# EAGLE design ZPlusSunSensorBoard (EAGLE 9.6.2)
DESIGNER: T. Christison
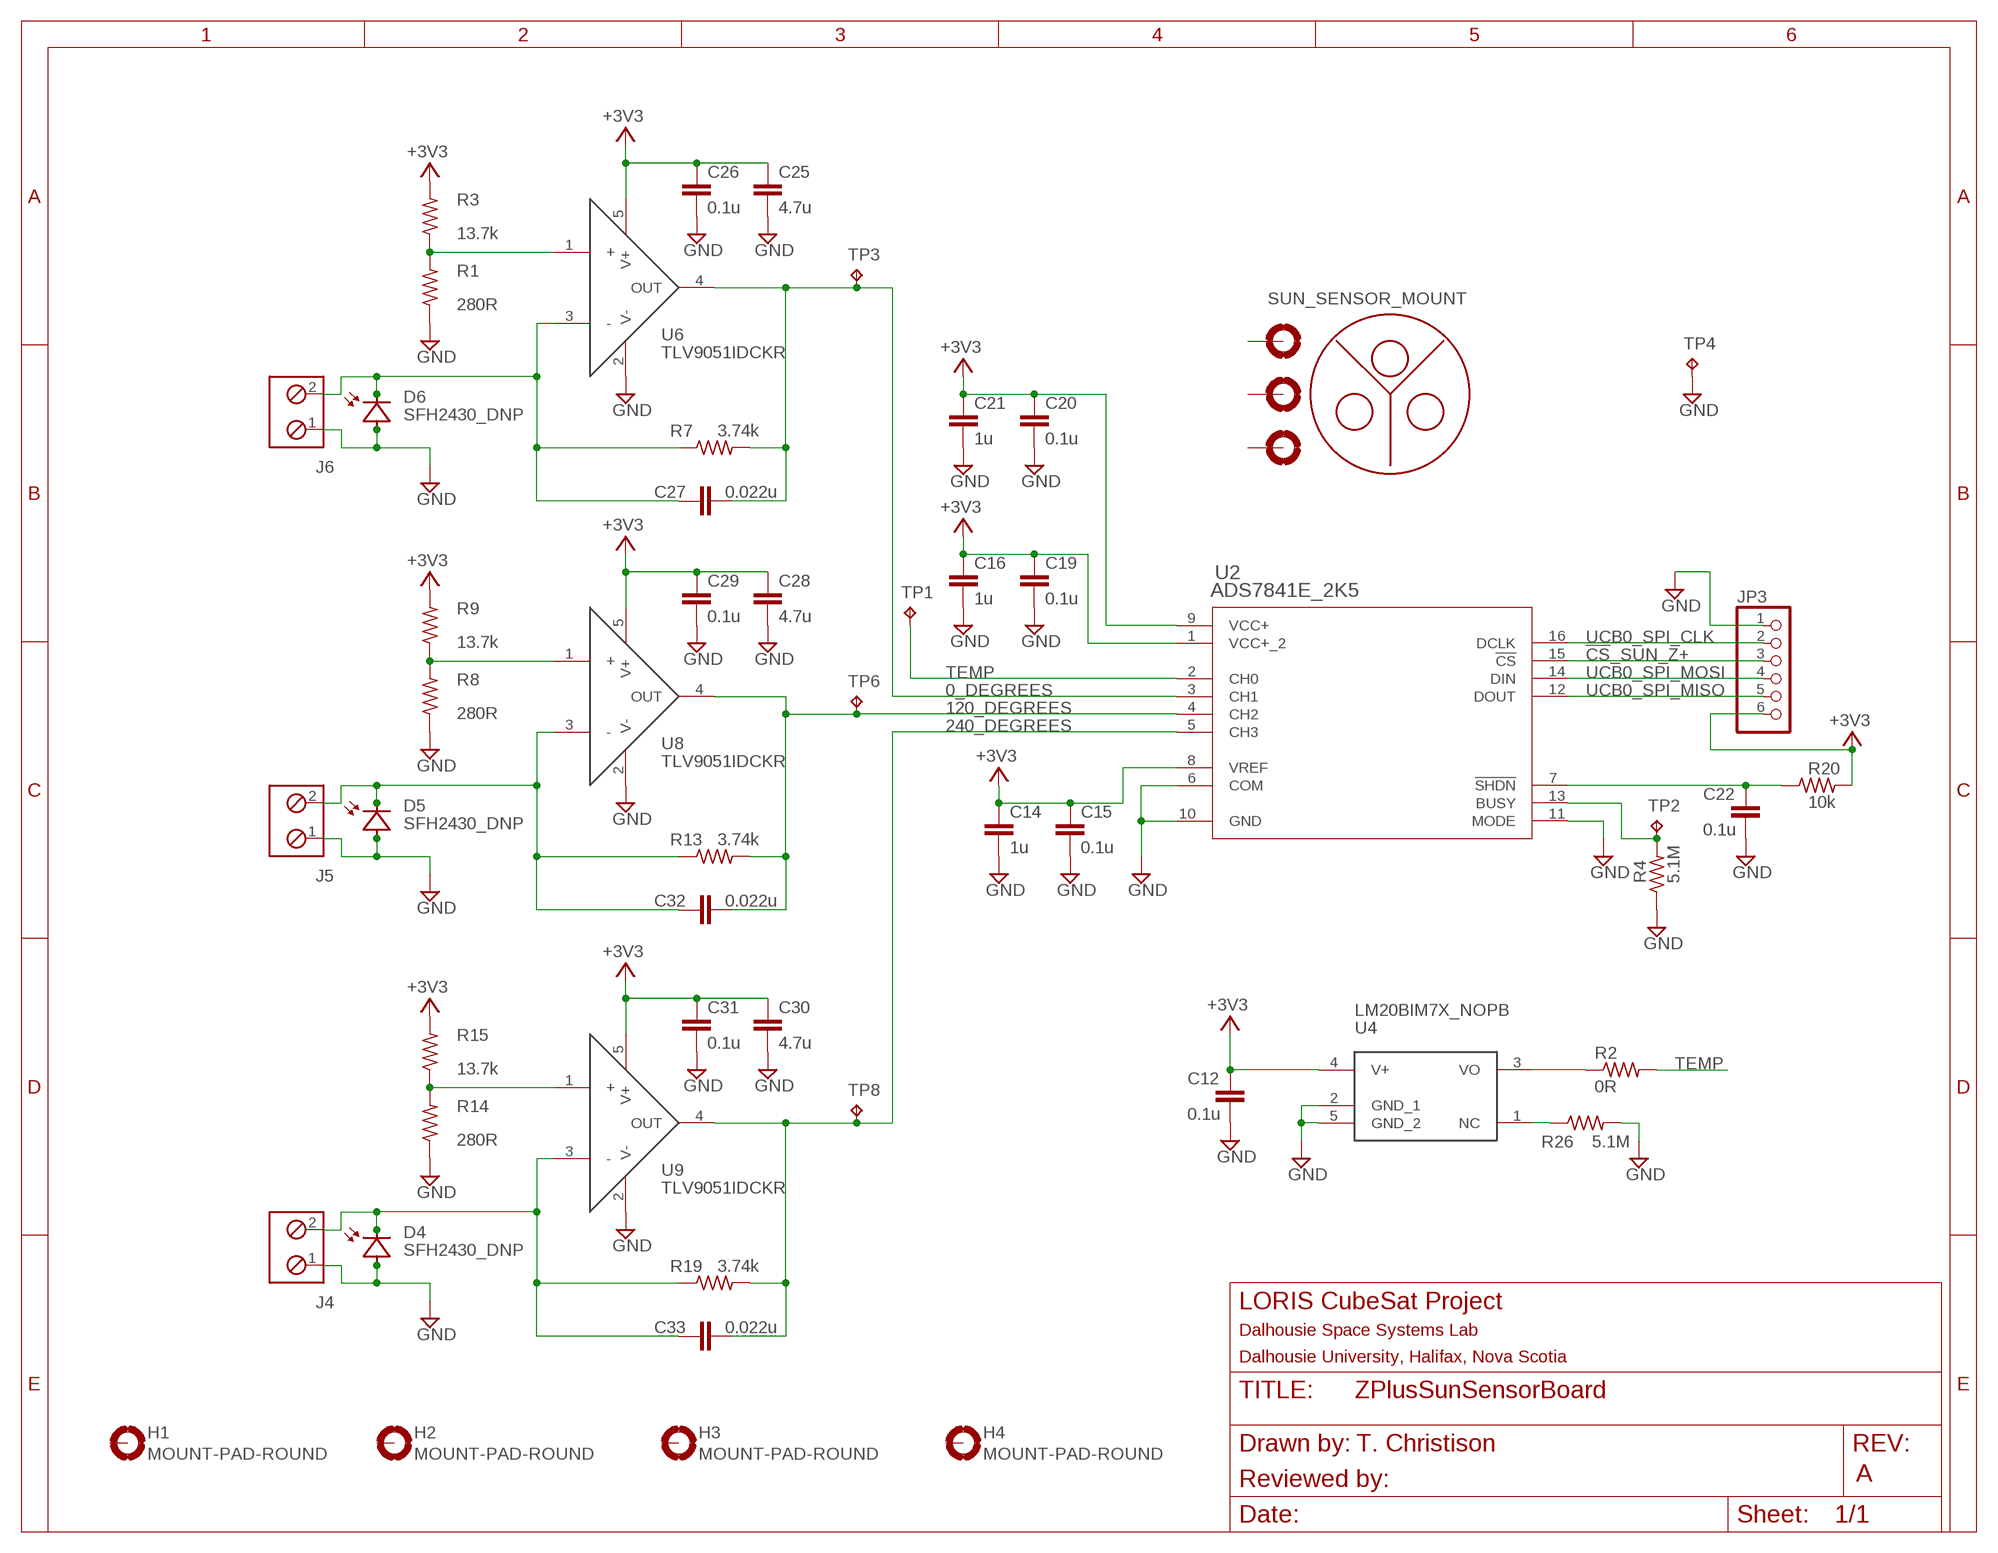
[diagram p0: schematic, sheet 1]

## Parts
A1  SUN_SENSOR_MOUNT  [SUN_SENOR_MASK]
C12  0.1u  C-EUC0402  [C0402]
C14  1u  C-EUC0402  [C0402]
C15  0.1u  C-EUC0402  [C0402]
C16  1u  C-EUC0402  [C0402]
C19  0.1u  C-EUC0402  [C0402]
C20  0.1u  C-EUC0402  [C0402]
C21  1u  C-EUC0402  [C0402]
C22  0.1u  C-EUC0402  [C0402]
C25  4.7u  C-EUC0805  [C0805]
C26  0.1u  C-EUC0402  [C0402]
C27  0.022u  C-EUC0402  [C0402]
C28  4.7u  C-EUC0805  [C0805]
C29  0.1u  C-EUC0402  [C0402]
C30  4.7u  C-EUC0805  [C0805]
C31  0.1u  C-EUC0402  [C0402]
C32  0.022u  C-EUC0402  [C0402]
C33  0.022u  C-EUC0402  [C0402]
H1  MOUNT-PAD-ROUND  [PC104]
H2  MOUNT-PAD-ROUND  [PC104]
H3  MOUNT-PAD-ROUND  [PC104]
H4  MOUNT-PAD-ROUND  [PC104]
J4  TRM_BLK_1X2  [2POL254]
J5  TRM_BLK_1X2  [2POL254]
J6  TRM_BLK_1X2  [2POL254]
JP3  PINHD-1X6  [1X06]
R1  280R  R-US_R0402  [R0402]
R2  0R  R-US_R0805  [R0805]
R3  13.7k  R-US_R0402  [R0402]
R4  5.1M  R-US_R0402  [R0402]
R7  3.74k  R-US_R0402  [R0402]
R8  280R  R-US_R0402  [R0402]
R9  13.7k  R-US_R0402  [R0402]
R13  3.74k  R-US_R0402  [R0402]
R14  280R  R-US_R0402  [R0402]
R15  13.7k  R-US_R0402  [R0402]
R19  3.74k  R-US_R0402  [R0402]
R20  10k  R-US_R0402  [R0402]
R26  5.1M  R-US_R0402  [R0402]
TP1  TESTPOINT  [TP_P76H50]
TP2  TESTPOINT  [TP_P76H50]
TP3  TESTPOINT  [TP_P76H50]
TP4  TESTPOINT  [TP_P76H50]
TP6  TESTPOINT  [TP_P76H50]
TP8  TESTPOINT  [TP_P76H50]
U2  ADS7841E_2K5  [DBQ16]
U4  LM20BIM7X_NOPB  [SOT23-5P65_210X110L40X22N_LM20]
U6  TLV9051IDCKR  [SC70-5P65_210X110L36X22N_TLV9051]
U8  TLV9051IDCKR  [SC70-5P65_210X110L36X22N_TLV9051]
U9  TLV9051IDCKR  [SC70-5P65_210X110L36X22N_TLV9051]

## Nets
0_DEGREES: C27.2 R7.2 TP3.1(TP) U2.3(CH1) U6.4(OUT)
120_DEGREES: C32.2 R13.2 TP6.1(TP) U2.4(CH2) U8.4(OUT)
240_DEGREES: C33.2 R19.2 TP8.1(TP) U2.5(CH3) U9.4(OUT)
!CS!_SUN_Z+: JP3.3 U2.15(!CS)
+3V3: C12.1 C14.1 C15.1 C16.1 C19.1 C20.1 C21.1 C25.1 C26.1 C28.1 C29.1 C30.1 C31.1 JP3.6 R3.2 R9.2 R15.2 R20.2 U2.1(VCC+_2) U2.8(VREF) U2.9(VCC+) U4.4(V+) U6.5(V+) U8.5(V+) U9.5(V+)
GND: C12.2 C14.2 C15.2 C16.2 C19.2 C20.2 C21.2 C22.2 C25.2 C26.2 C28.2 C29.2 C30.2 C31.2 J4.1 J5.1 J6.1 JP3.1 R1.1 R4.1 R8.1 R14.1 R26.2 TP4.1(TP) U2.6(COM) U2.10(GND) U2.11(MODE) U4.2(GND_1) U4.5(GND_2) U6.2(V-) U8.2(V-) U9.2(V-)
N$1: R2.1 U4.3(VO)
N$2: R4.2 TP2.1(TP) U2.13(BUSY)
N$3: C27.1 J6.2 R7.1 U6.3(-)
N$6: R1.2 R3.1 U6.1(+)
N$7: R26.1 U4.1(NC)
N$8: C32.1 J5.2 R13.1 U8.3(-)
N$9: R8.2 R9.1 U8.1(+)
N$12: C33.1 J4.2 R19.1 U9.3(-)
N$13: R14.2 R15.1 U9.1(+)
N$15: C22.1 R20.1 U2.7(!SHDN)
TEMP: R2.2 TP1.1(TP) U2.2(CH0)
UCB0_SPI_CLK: JP3.2 U2.16(DCLK)
UCB0_SPI_MISO: JP3.5 U2.12(DOUT)
UCB0_SPI_MOSI: JP3.4 U2.14(DIN)
Unconnected: A1.P$1(MOUNT) A1.P$2(MOUNT1) A1.P$3(MOUNT2) H1.B3,15(MOUNT) H2.B3,15(MOUNT) H3.B3,15(MOUNT) H4.B3,15(MOUNT)

## Notes on the sheet
- T. Christison
- A

## Library data of the parts
A1 = my_library:SUN_SENSOR_MOUNT
C12 C25 C28 C30 = rcl:C-EU: CAPACITOR, European symbol; SPICEPREFIX: C
C14-C16 C19-C22 C26 C27 C29 C31-C33 = resistor:C-EU: CAPACITOR, European symbol
H1-H4 = my_library:MOUNT-PAD-ROUND: MOUNTING PAD, round
J4-J6 = my_library:TRM_BLK_1X2: PHOENIX CONNECTOR; OC_FARNELL: unknown; OC_NEWARK: unknown
JP3 = my_library:PINHD-1X6: PIN HEADER
R1 R3 R4 R7-R9 R13-R15 R19 R20 = resistor:R-US_: RESISTOR, American symbol
R2 R26 = rcl:R-US_: RESISTOR, American symbol; SPICEPREFIX: R
TP1-TP4 TP6 TP8 = my_library:TESTPOINT
U2 = my_library:ADS7841E_2K5; DATASHEET_URL: http://www.ti.com/lit/gpn/ADS7841; DESCRIPTION: 12-Bit, 4-Channel Serial Output Sampling Analog-to-Digital Converter; FAMILY_NAME: PRECISION ADC (<=10MSPS); GENERIC_PART_NUMBER: ADS7841; INDUSTRY_STD_PKG_TYPE: SSOP/QSOP; MANUFACTURER: Texas Instruments; PACKAGE_DESIGNATOR: DBQ; PIN_COUNT: 16
U4 = my_library:LM20BIM7X_NOPB
U6 U8 U9 = my_library:TLV9051

## Board
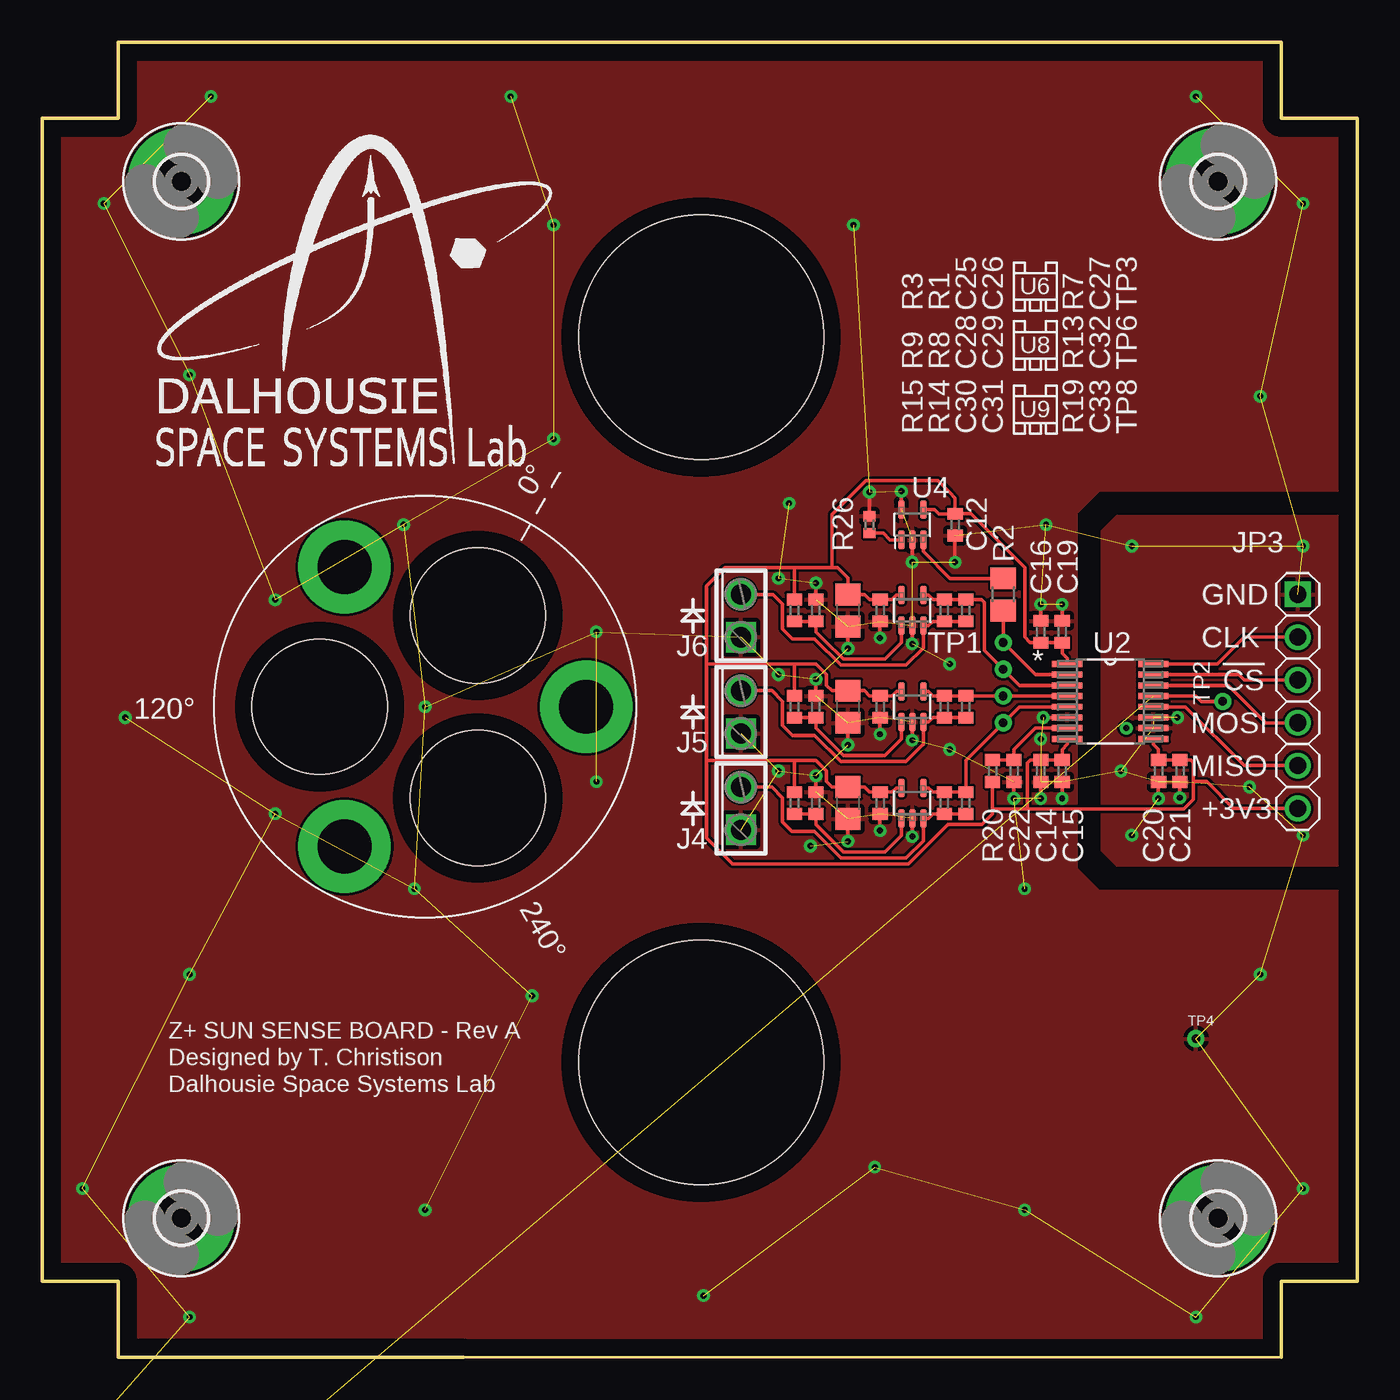
[diagram p1: board, top side]
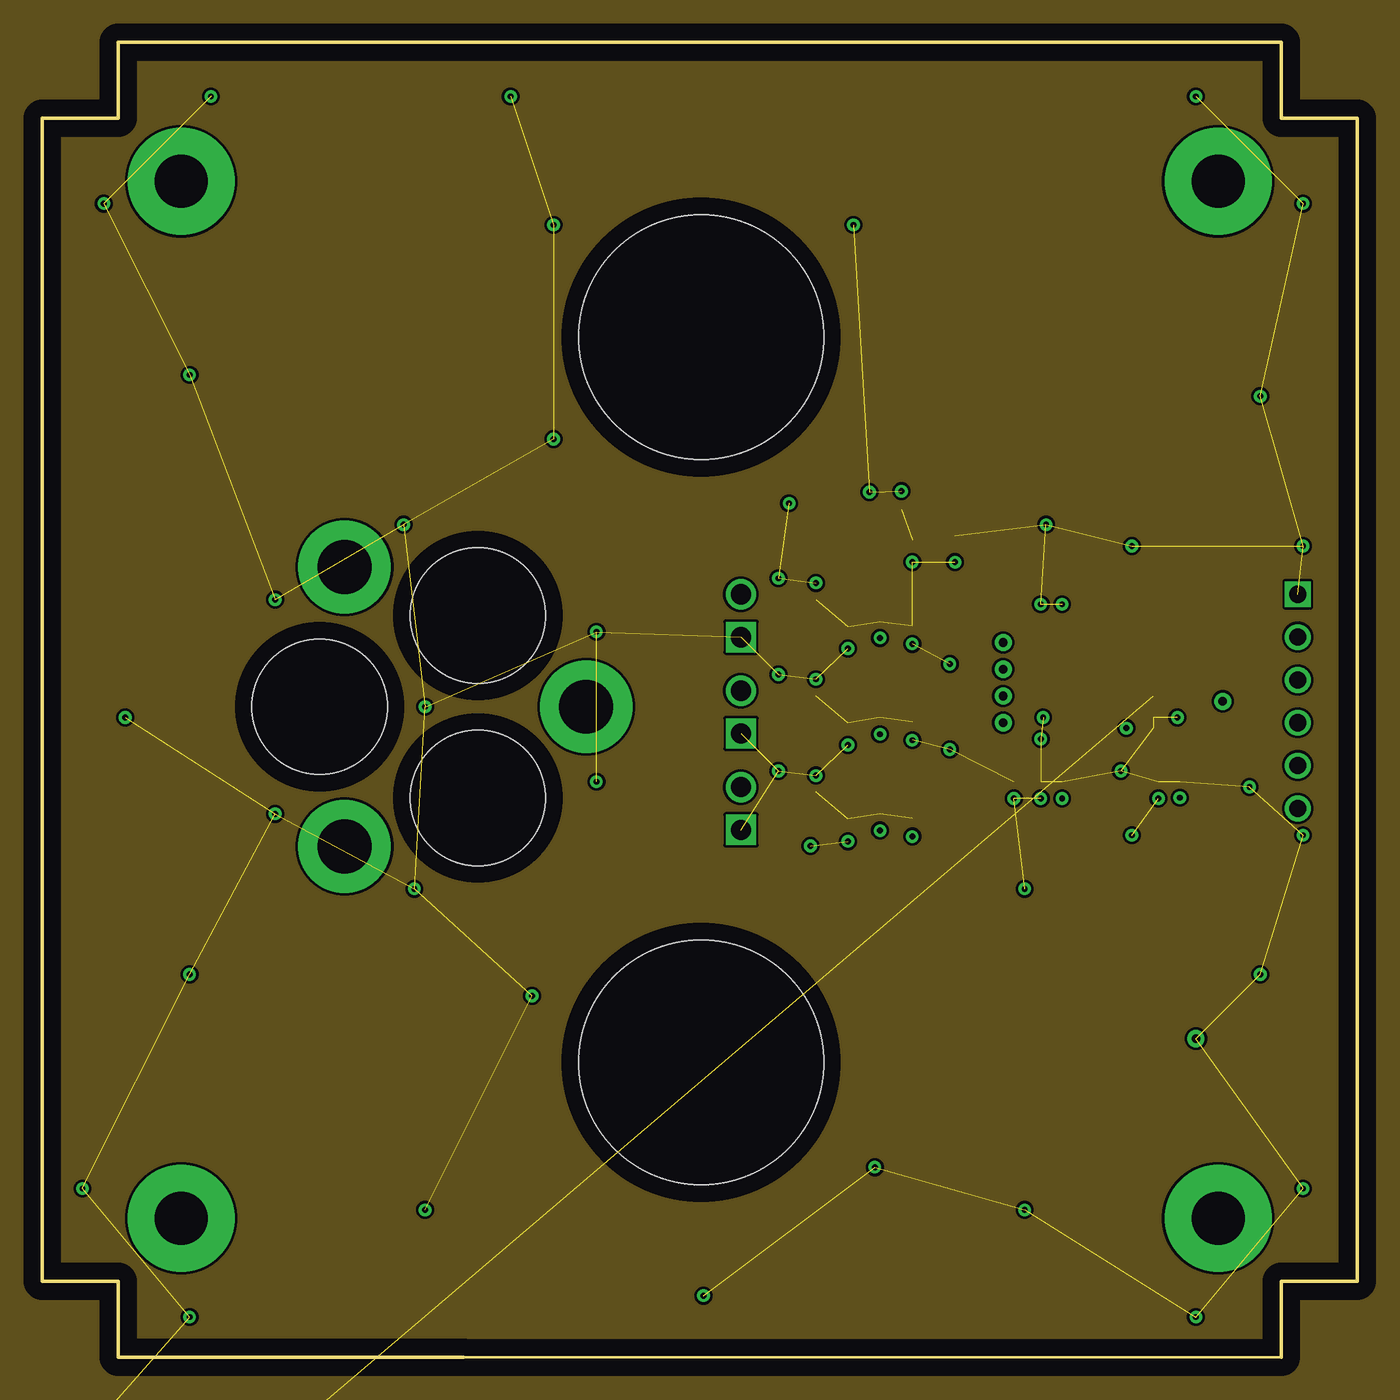
[diagram p2: board, inner layer Route2]
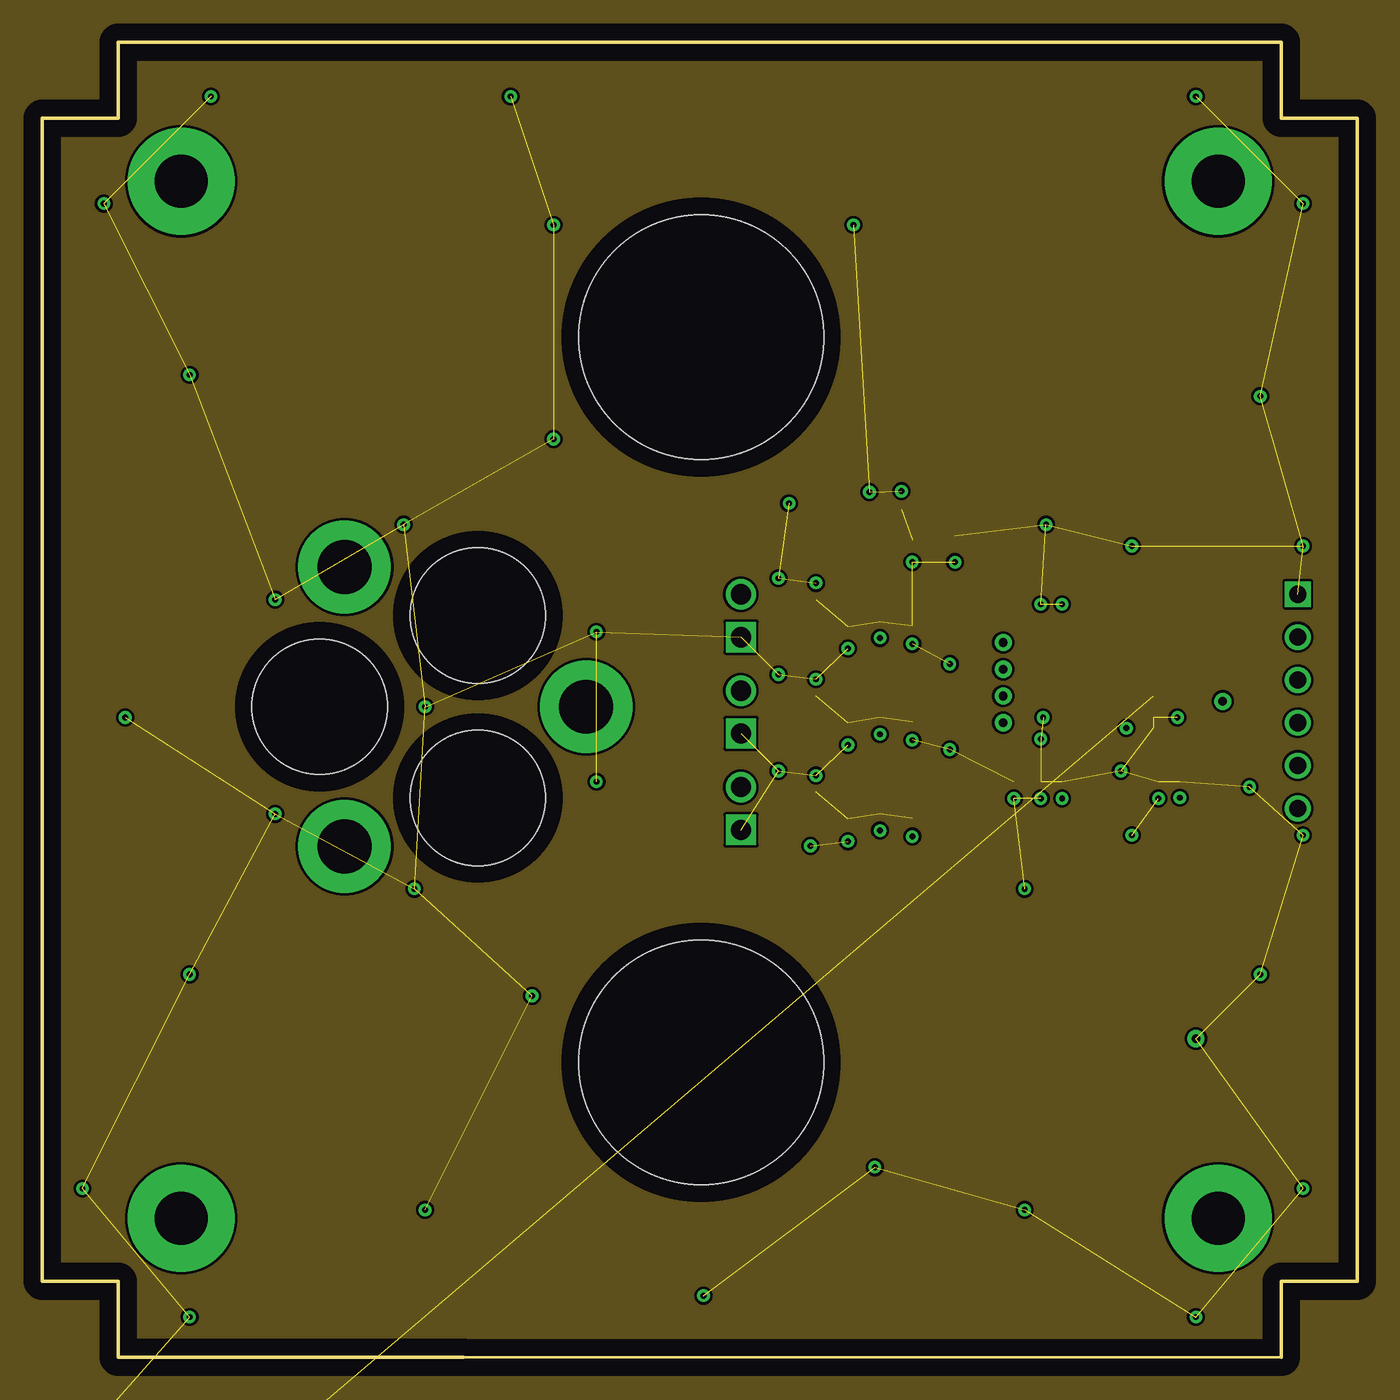
[diagram p3: board, inner layer Route15]
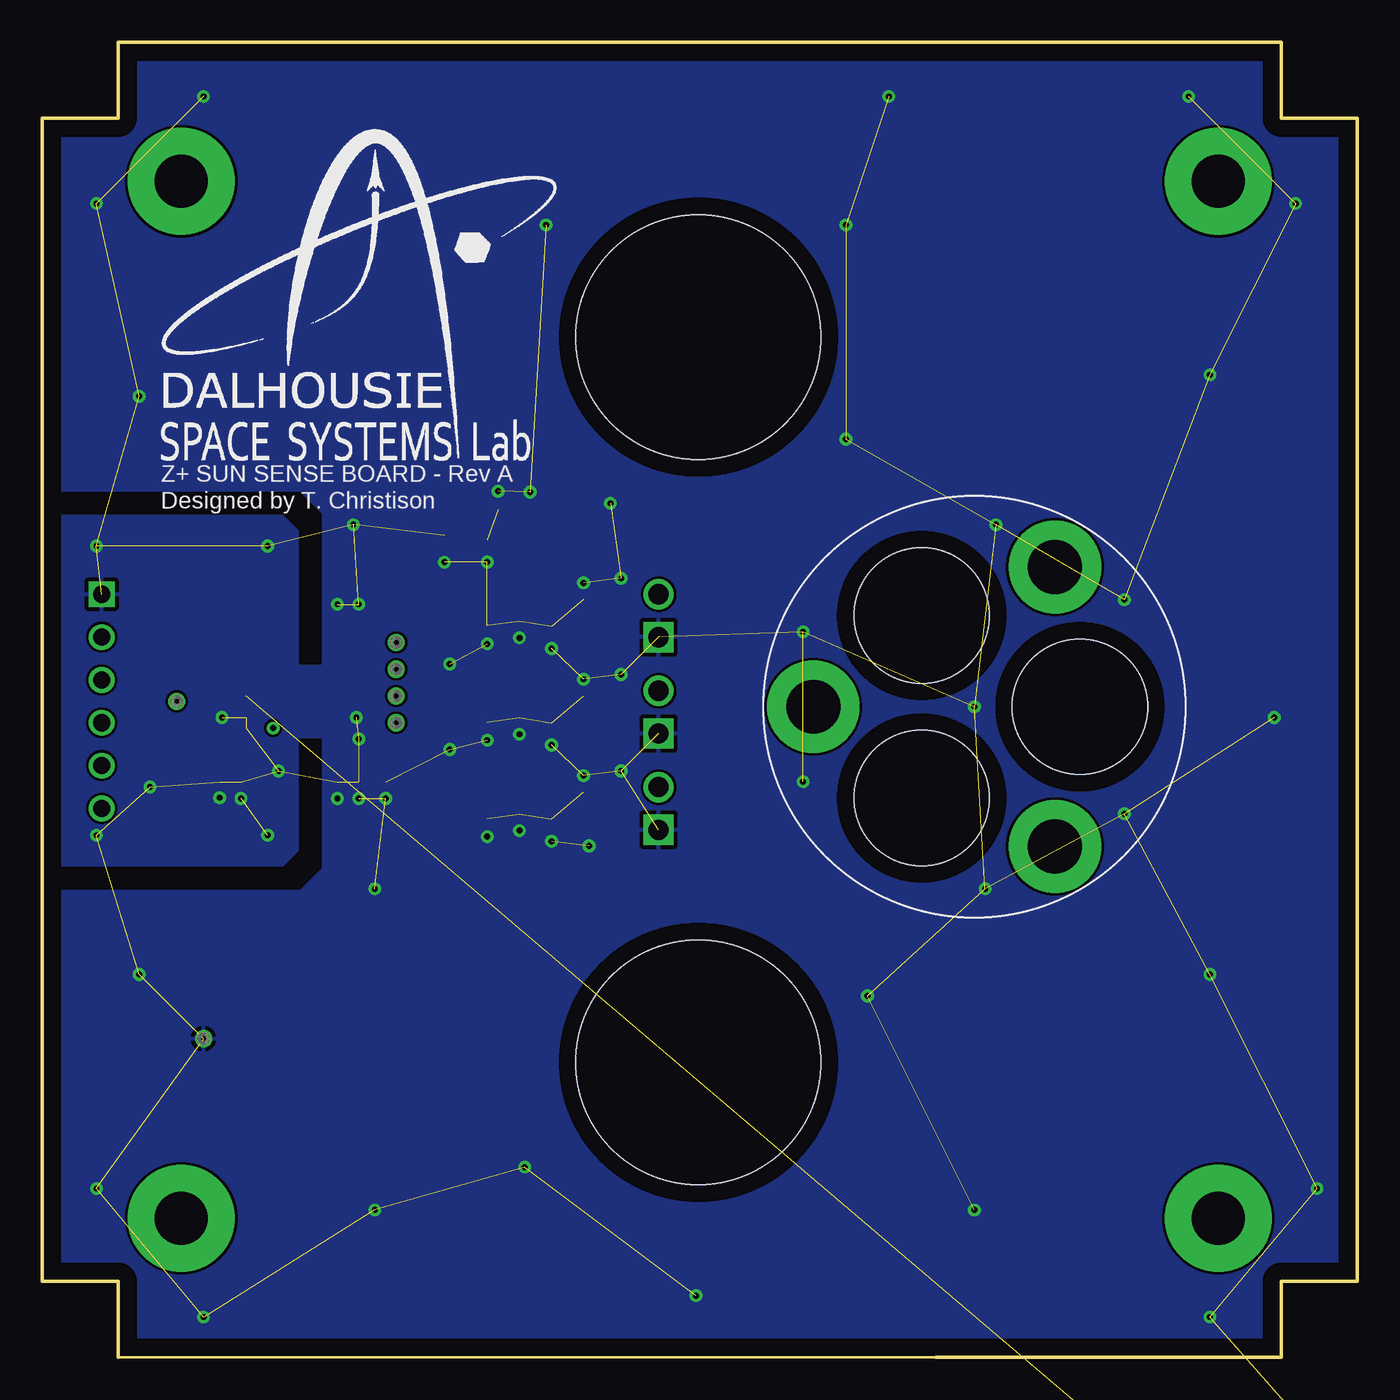
[diagram p4: board, bottom side, seen from below]

Size 78 x 78 mm. Coordinates in mm from the lower left corner, seen from the top.
Outline: 25,0 73.5,0 73.5,4.5 78,4.5 78,73.5 73.5,73.5 73.5,78 4.5,78 4.5,73.5 0,73.5 0,4.5 4.5,4.5 4.5,0 25,0
Copper layers (1*16): Top 0.035mm / dielectric 1.5mm / Bottom 0.035mm
Design rules "default": minimum track width 6mil, minimum drill 0.35mm, track to track 6mil, track to pad 6mil, pad to pad 6mil, via to via 6mil, smd to smd 6mil, copper to edge 40mil, drill to drill 6mil, minimum pad ring 10mil, minimum via ring 8mil, stop-mask expansion 4mil, vias tented up to drill 0mil, thermal gap 10mil
Holes 14.5 mm at 39.08,60.5 39.08,17.5

### Footprints (pad centres in the part's own frame; a part is rotated, then mirrored left to right if it is on the bottom)
SUN_SENOR_MASK = drill 3.2 pad 5.5: P$1 -9.56,0; P$2 4.78,8.279; P$3 4.78,-8.279 | hole 8: 6.25,0; -3.125,5.413; -3.125,-5.413
C0402 = smd 0.7 x 0.9: 1 -0.65,0; 2 0.65,0
C0805 = smd 1.3 x 1.5: 1 -0.95,0; 2 0.95,0
PC104 = drill 3.15 pad 6.35: B3,15 0,0
2POL254 = drill 1.2 square: 1 -1.27,0 | drill 1.2: 2 1.27,0
1X06 = drill 1.016 square: 1 -6.35,0 | drill 1.016: 2 -3.81,0; 3 -1.27,0; 4 1.27,0; 5 3.81,0; 6 6.35,0
R0402 = smd 0.7 x 0.9: 1 -0.65,0; 2 0.65,0
R0805 = smd 1.3 x 1.5: 1 -0.95,0; 2 0.95,0
R0402' = smd 0.6 x 0.7: 1 -0.5,0; 2 0.5,0
TP_P76H50 = drill 0.51 pad 0.762: 1 0,0
DBQ16 = smd 1.803 x 0.356: 1 -2.553,2.223; 2 -2.553,1.587; 3 -2.553,0.953; 4 -2.553,0.318; 5 -2.553,-0.318; 6 -2.553,-0.953; 7 -2.553,-1.587; 8 -2.553,-2.223; 9 2.553,-2.223; 10 2.553,-1.587; 11 2.553,-0.953; 12 2.553,-0.318; 13 2.553,0.318; 14 2.553,0.953; 15 2.553,1.587; 16 2.553,2.223
SOT23-5P65_210X110L40X22N_LM20 = smd 0.38 x 1.11: 1 -0.65,-0.9; 2 0,-0.9; 3 0.65,-0.9; 4 0.65,0.9; 5 -0.65,0.9
SC70-5P65_210X110L36X22N_TLV9051 = smd 0.38 x 1.09: 1 -0.65,-0.91; 2 0,-0.91; 3 0.65,-0.91; 4 0.65,0.91; 5 -0.65,0.91

### Placement (x,y rotation side)
A1  22.71,38.59 60 top
C12  54.14,49.38 270 top
C14  59.22,34.77 270 top
C15  60.49,34.77 270 top
C16  59.22,43.03 90 top
C19  60.49,43.03 90 top
C20  66.21,34.77 270 top
C21  67.48,34.77 270 top
C22  57.64,34.77 270 top
C25  47.79,44.3 270 top
C26  49.7,44.3 270 top
C27  54.78,44.3 90 top
C28  47.79,38.59 270 top
C29  49.7,38.59 270 top
C30  47.79,32.87 270 top
C31  49.7,32.87 270 top
C32  54.78,38.59 90 top
C33  54.78,32.87 90 top
DRILEGEND  [DRILEGEND]  -11.08,-14.25 0 top  (outside the outline)
H1  8.25,69.75 0 top
H2  8.25,8.25 0 top
H3  69.75,8.25 0 top
H4  69.75,69.75 0 top
J4  41.44,32.55 90 top
J5  41.44,38.27 90 top
J6  41.44,43.98 90 top
JP3  74.46,38.9 270 top
R1  45.89,44.3 270 top
R2  57,45.25 270 top
R3  44.62,44.3 90 top
R4  -28.73,-40.79 0 top  (outside the outline)
R7  53.51,44.3 90 top
R8  45.89,38.59 270 top
R9  44.62,38.59 90 top
R13  53.51,38.59 90 top
R14  45.89,32.87 270 top
R15  44.62,32.87 90 top
R19  53.51,32.87 90 top
R20  56.37,34.77 270 top
R26  5.1M  [R0402']  49.06,49.38 90 top
TP1  57,42.4 180 top
TP2  70.02,38.9 0 top
TP3  57,40.81 180 top
TP4  68.43,18.9 0 top
TP6  57,39.22 180 top
TP8  57,37.63 180 top
U2  63.35,38.9 0 top
U4  51.6,49.38 0 top
U6  51.6,44.3 0 top
U8  51.6,38.59 0 top
U9  51.6,32.87 0 top

### Tracks (layer width: path | path; a pad name or v marks a point on that pad's centre or on a via)
0_DEGREES
  Top 0.203: U6.4 52.55,45.21 52.81,44.95 R7.2 C27.2 55.72,44.95 55.89,44.78 55.89,41.92 TP3.1 57.95,39.85 U2.3
120_DEGREES
  Top 0.203: U8.4 52.55,39.49 52.81,39.23 R13.2 C32.2 54.79,39.22 TP6.1 U2.4
240_DEGREES
  Top 0.203: U9.4 52.55,33.78 52.81,33.52 R19.2 C33.2 54.78,35.41 TP8.1 57.95,38.59 U2.5
!CS!_SUN_Z+
  Top 0.203: U2.15 70.97,40.49 71.29,40.17 JP3.3
+3V2
  pour Route15 (rank 6, no thermals): -10.95,87.48 -10.95,-10.31 88.75,-10.31 88.75,86.21 88.75,87.48
+3V3
  Top 0.203: U6.5 50.65,45.21 50.39,44.95 C26.1 49.06,44.95 48.76,45.25 C25.1 47.79,46.2 47.16,46.84 46.84,46.84 | 66.21,35.73 66.21,36.05 65.9,36.35 U2.9 | 66.21,35.73 C20.1 | 66.21,35.73 66.51,35.42 C21.1 68.11,35.42 68.28,35.26 68.28,34.14 | U2.1 60.8,41.44 60.49,41.75 C19.1 60.47,42.41 59.25,42.41 C16.1 59.21,42.4 58.59,42.4 58.27,42.71 58.27,46.84 55.08,50.03 C12.1 | U8.5 50.65,39.49 50.39,39.23 C29.1 49.06,39.23 48.76,39.53 C28.1 46.84,39.53 46.52,39.86 46.52,40.49 45.88,41.12 44.62,41.12 | U2.8 60.8,36.36 60.49,36.06 C15.1 C14.1 58.6,35.42 58.43,35.25 58.43,32.56 58.48,32.51 | U9.5 50.65,33.78 50.39,33.52 C31.1 49.06,33.52 48.76,33.82 C30.1 46.84,33.82 46.52,34.14 46.52,34.77 45.89,35.41 44.62,35.41 | 52.27,50.3 U4.4 52.92,50.28 53.19,50.02 54.13,50.02 C12.1 | R3.2 44.62,46.84 | R9.2 44.62,41.12 | R15.2 44.62,35.41 | 44.62,46.84 40.5,46.84 39.39,45.73 39.39,41.12 | 44.62,46.84 46.84,46.84 | R20.2 56.37,32.55 | 56.37,32.55 56.37,32.23 55.73,31.6 53.72,31.6 51.38,29.26 40.93,29.26 39.39,30.8 39.39,35.41 | 68.28,34.14 68.28,33.09 67.7,32.51 58.48,32.51 | 58.48,32.51 56.41,32.51 56.37,32.55 | 39.39,35.41 39.39,41.12 | 44.62,41.12 39.39,41.12 | 44.62,35.41 39.39,35.41 | C12.1 54.14,50.97 53.83,51.28 53.11,52 51.23,52 48.86,52 46.84,49.98 46.84,46.84 | JP3.6 70.65,32.55 69.06,34.14 68.28,34.14
GND  (via drill 0.35)  (77 unrouted)
  Top 0.203: R26.2 v49.06,51.31 | v51.6,47.17 U4.2 | U4.5 50.97,50.3 v50.97,51.37 | v54.14,47.16 C12.2 | U2.6 v59.36,37.95 | C15.2 v60.49,33.14 | C16.2 v59.22,44.66 | C19.2 v60.49,44.66 | C25.2 v47.79,42.03 | C26.2 v49.7,42.67 | U6.2 v51.6,42.31 | R1.1 v45.89,45.93 | C28.2 v47.79,36.32 | C29.2 v49.7,36.95 | U8.2 v51.6,36.6 | R8.1 v45.89,40.22 | C30.2 v47.79,30.6 | C31.2 v49.7,31.24 | U9.2 v51.6,30.88 | R14.1 v45.89,34.5 | C20.2 v66.21,33.14 | C21.2 v67.48,33.19 | v57.64,33.14 C22.2 | v59.22,33.14 C14.2
  other vias: 67.33,37.95 64.62,48.11 74.78,48.11 63.98,34.77 71.61,33.82 64.62,30.97 74.78,30.97 3.66,68.43 8.74,58.27 10.01,74.78 27.79,74.78 30.33,67.16 48.11,67.16 30.33,54.46 44.3,50.65 59.54,49.38 72.24,57 74.78,68.43 68.43,74.78 58.27,27.79 72.24,22.71 49.38,11.28 58.27,8.74 68.43,2.39 74.78,10.01 39.22,3.66 29.06,21.44 22.71,8.74 8.74,2.39 2.39,10.01 8.74,22.71 22.07,27.79 13.82,32.23 4.93,37.95 13.82,44.94 22.71,38.59 32.87,34.14 32.87,43.03 21.44,49.38 43.66,46.2 43.66,40.49 43.66,34.77 53.83,36.05 53.83,41.12 45.57,30.33 59.22,36.68
  pour Bottom: -8.72,86.53 -8.72,-8.72 6.52,-8.72 86.53,-8.72 86.53,87.8 83.35,87.8 -8.72,87.8
  pour Top: -3.96,82.4 82.4,82.4 82.4,-4.59 -3.96,-4.59
  cutout Top: 77.32,51.28 62.72,51.28 61.44,50.02 61.44,29.06 62.72,27.79 77.32,27.79 77.32,29.06 63.67,29.06 62.72,30.01 62.72,49.06 63.67,50.02 77.32,50.02
  cutout Bottom: 77.32,51.28 62.72,51.28 61.44,50.02 61.44,41.12 62.72,41.12 62.72,49.06 63.67,50.02 77.32,50.02
  cutout Bottom: 61.44,36.68 62.72,36.68 62.72,30.01 63.67,29.06 77.32,29.06 77.32,27.79 62.72,27.79 61.44,29.06
GND2
  pour Route2 (no thermals): -7.13,85.58 85.58,85.58 85.58,-7.13 -7.13,-7.13
N$1
  Top 0.203: U4.3 52.25,47.78 53.83,46.2 R2.1
N$2  (1 unrouted)
  Top 0.203: U2.13 68.43,39.22 68.75,38.9 TP2.1
N$3
  Top 0.203: C27.1 R7.1 52.81,43.65 52.55,43.39 U6.3 52.25,42.07 51.23,41.05 47.37,41.05 45.81,42.6 44.51,42.6 43.91,43.2 43.91,44.69 43.35,45.25 J6.2
N$4  (via drill 0.35)
  other vias: 64.3,37.31
N$6
  Top 0.203: R1.2 | U6.1 50.95,42.38 49.98,41.4 47.53,41.4 46.38,42.55 46.36,42.55 45.89,43.03 R1.2 | R3.1 R1.2
N$7
  Top 0.203: R26.1 49.88,48.88 50.28,48.48 U4.1
N$8
  Top 0.203: 52.25,36.36 U8.3 52.55,37.67 52.81,37.94 R13.1 C32.1 | 52.25,36.36 52.25,36.35 | J5.2 43.28,39.54 43.91,38.9 43.91,37.48 44.51,36.89 45.81,36.89 47.37,35.33 51.23,35.33 52.23,36.34 52.25,36.36
N$9
  Top 0.203: R8.2 | U8.1 50.95,36.66 49.98,35.69 47.53,35.69 46.38,36.84 46.36,36.84 45.89,37.31 R8.2 | R9.1 R8.2
N$12
  Top 0.203: C33.1 R19.1 52.81,32.22 52.55,31.96 U9.3 52.25,30.64 51.23,29.62 47.38,29.62 45.8,31.2 44.48,31.2 43.91,31.77 43.91,33.19 43.28,33.82 J4.2
N$13
  Top 0.203: R14.2 | U9.1 50.95,30.95 49.98,29.97 47.53,29.97 45.89,31.62 R14.2 | R15.1 R14.2
N$15
  Top 0.203: 59.54,37.31 58.91,37.31 57.64,36.05 C22.1 R20.1 | U2.7 59.54,37.31 | 59.54,37.31
TEMP
  Top 0.203: U2.2 58.91,40.49 TP1.1 R2.2
UCB0_SPI_CLK
  Top 0.203: U2.16 69.7,41.12 71.29,42.71 JP3.2
UCB0_SPI_MISO
  Top 0.203: U2.12 67.8,38.59 71.29,35.09 JP3.5
UCB0_SPI_MOSI
  Top 0.203: U2.14 70.33,39.85 72.56,37.63 JP3.4

### Text on the board
tPlace: U6 | U8 | U9 | Z+ SUN SENSE BOARD - Rev A | Designed by T. Christison | Dalhousie Space Systems Lab
bPlace: Z+ SUN SENSE BOARD - Rev A | Designed by T. Christison
tNames: GND | CLK | !CS | MOSI | MISO | +3V3
DrillLegend: LAYER-STACK
DrillLegend_01-16: 01-16
DrillLegend_01-20: 01-20